# Altium project IOT_temperature.PrjPcb
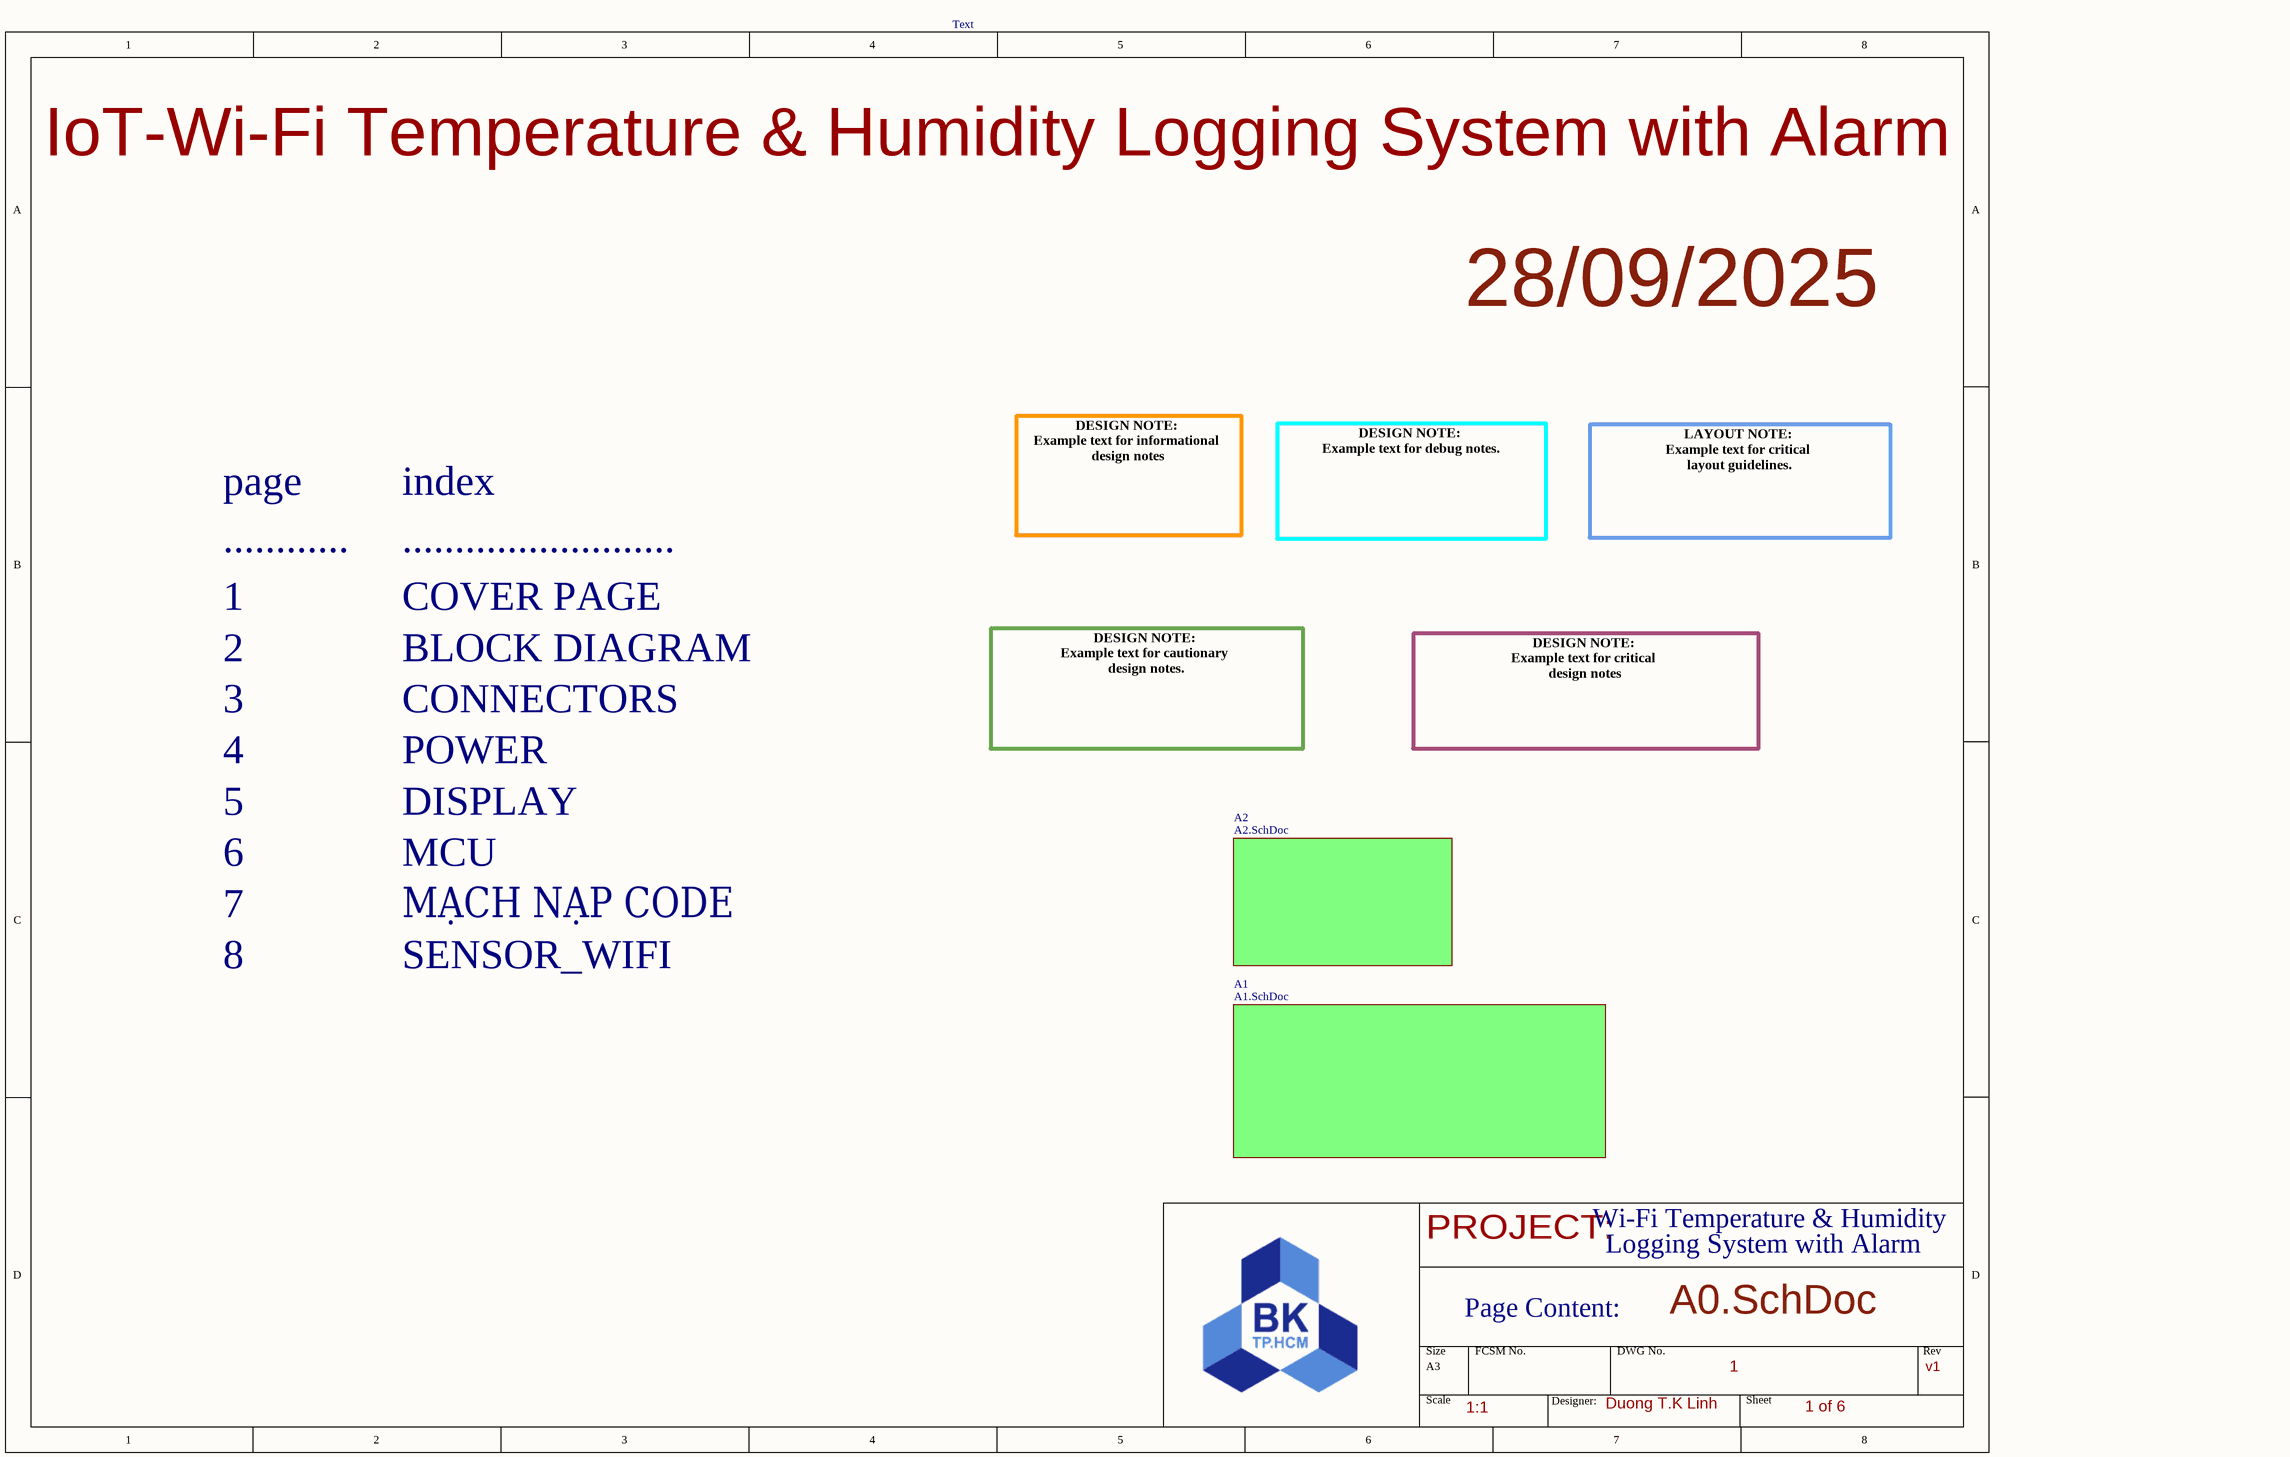
[diagram p0: A0.SchDoc]
6 sheets, 53 parts. Net scope: global (net labels, ports and power ports of the same name join across sheets).
Board files: PCB1.PcbDoc, PCB_IOT.PcbDoc
Sheets:
  A0.SchDoc
    A1 = A1.SchDoc
    A2 = A2.SchDoc
      poweranddisplay = power_display.SchDoc
      MCU = MCU.SchDoc
      sensor_wifi = sensor_wifi.SchDoc

## Sheet A0.SchDoc
size A3; SheetNumber: 1; SheetTotal: 6

### Sub-sheets
A1 = A1.SchDoc: no entries
A2 = A2.SchDoc: no entries

### Notes on the sheet
- Text
- IoT-Wi-Fi Temperature & Humidity Logging System with Alarm
- 28/09/2025
- page
- index
- ............
- ..........................
- DESIGN NOTE:
  Example text for informational
  design notes
- DESIGN NOTE:
  Example text for debug notes.
- LAYOUT NOTE:
  Example text for critical
  layout guidelines.
- 1
- COVER PAGE
- 2
- BLOCK DIAGRAM
- 3
- 4
- CONNECTORS
- POWER
- DESIGN NOTE:
  Example text for cautionary
  design notes.
- DESIGN NOTE:
  Example text for critical
  design notes
- 5
- DISPLAY
- 6
- MCU
- 7
- MẠCH NẠP CODE
- 8
- SENSOR_WIFI
- PROJECT:
- Wi-Fi Temperature & Humidity
- Logging System with Alarm
- Page Content:
- A0.SchDoc
- 1:1
- Designer:
- Duong T.K Linh
- 1 of 6
- v1

## Sheet A1.SchDoc
size A3; SheetNumber: 2; SheetTotal: 6
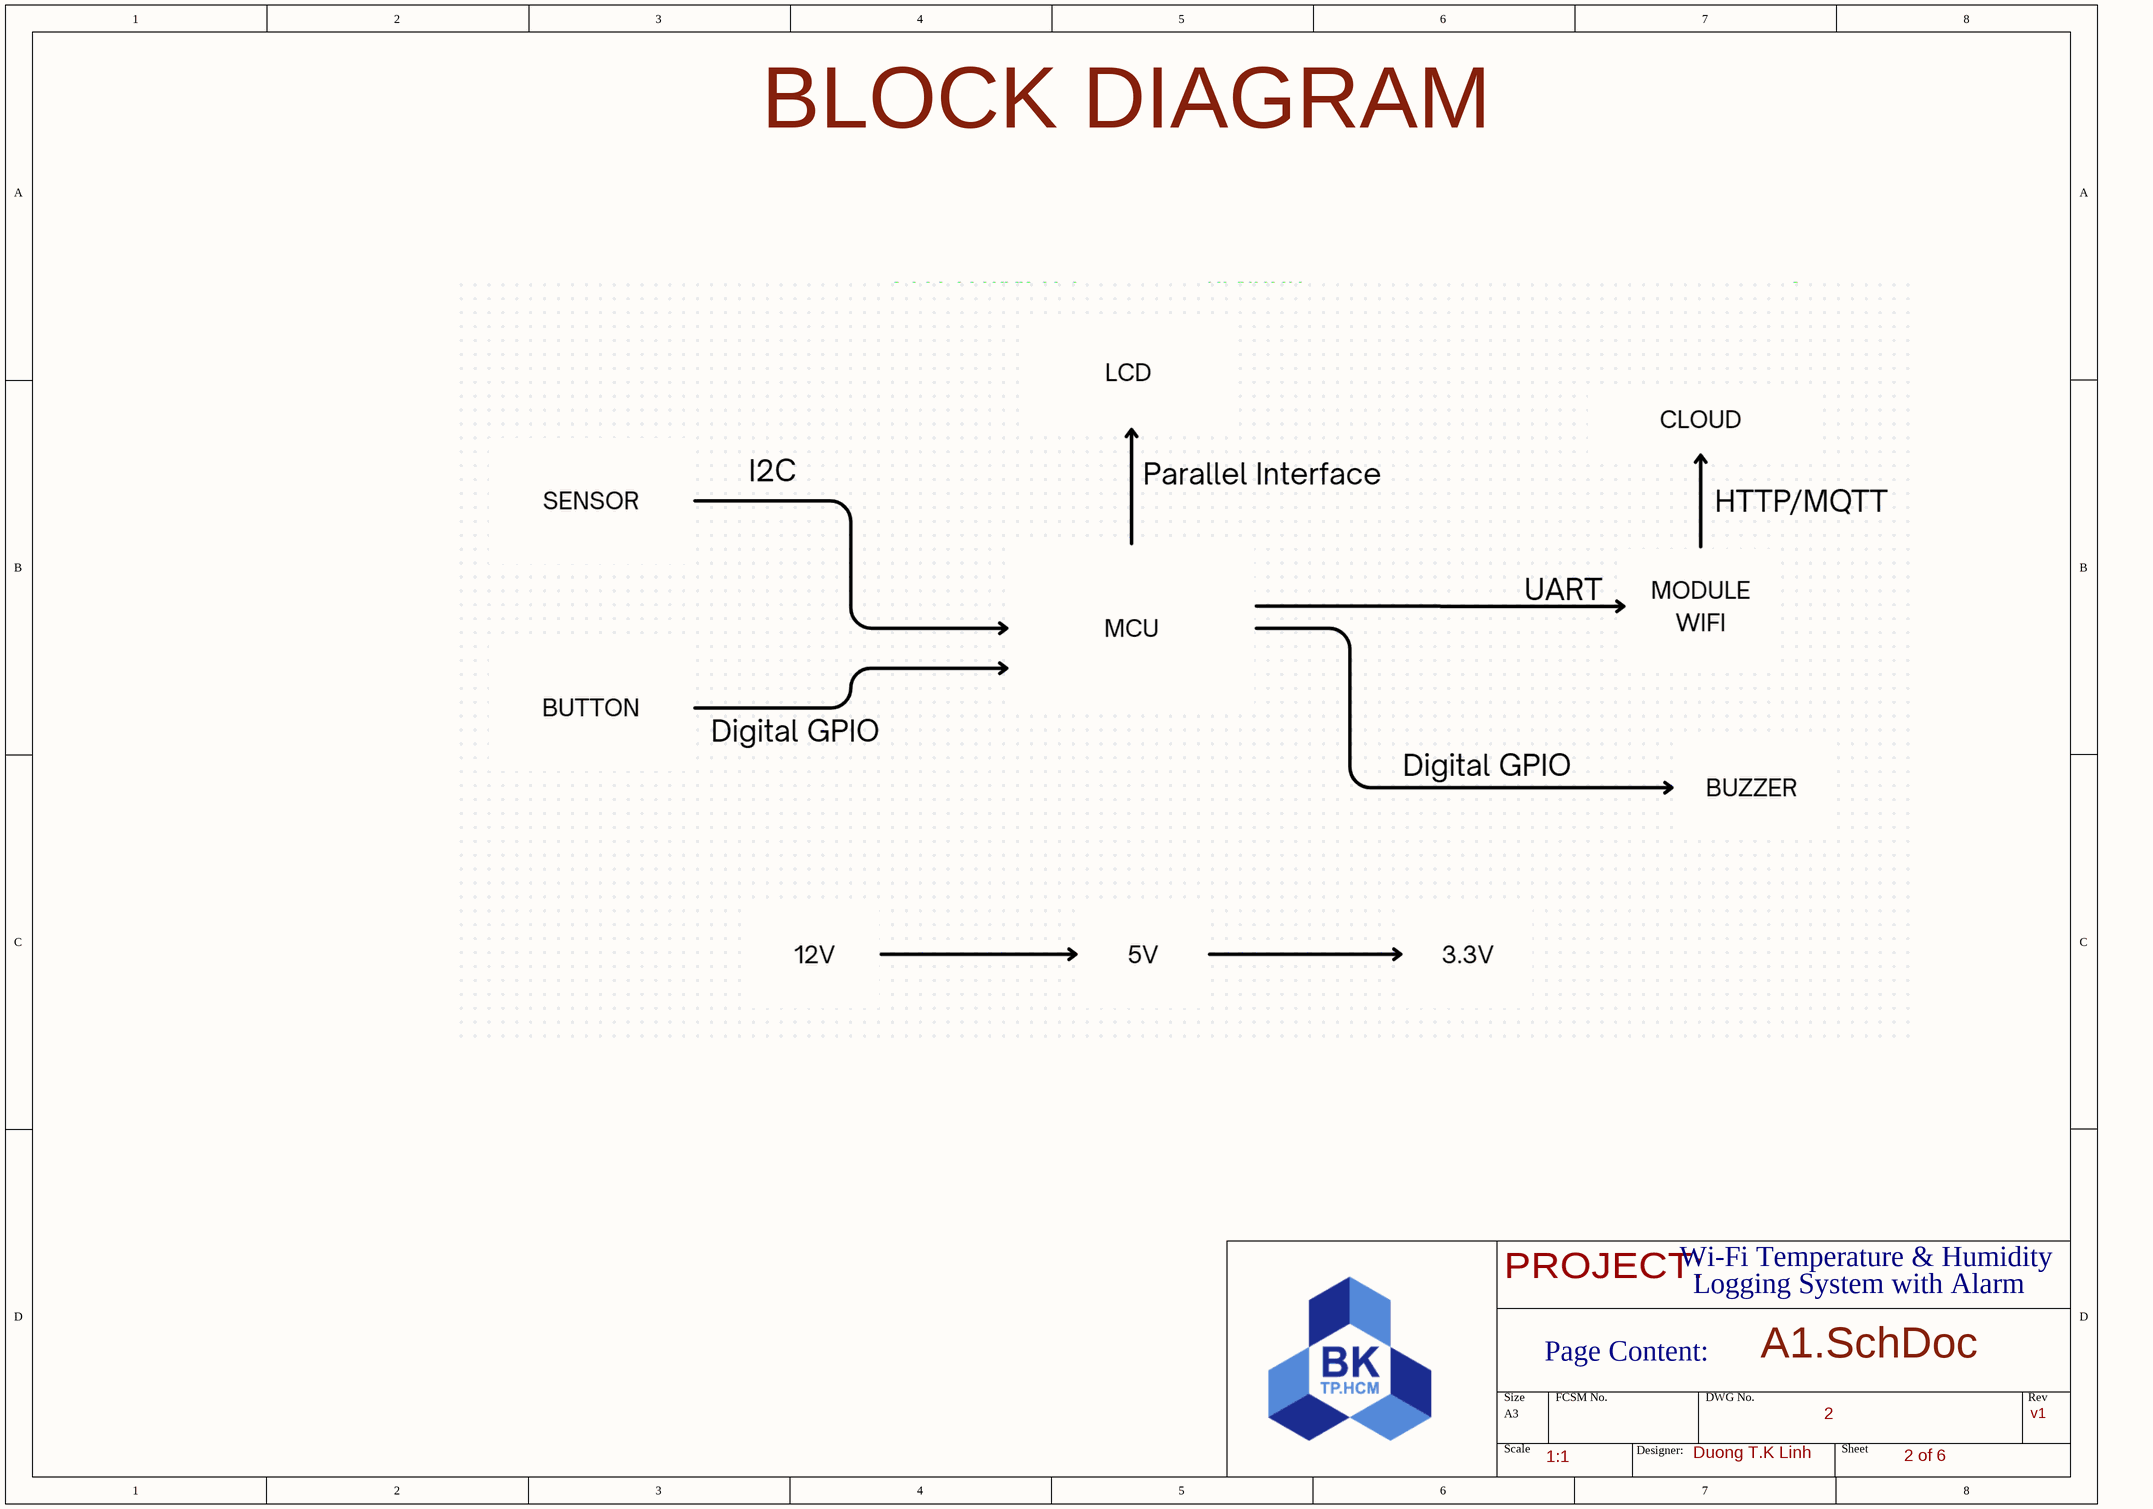
[diagram p1: A1.SchDoc]

### Notes on the sheet
- BLOCK DIAGRAM
- PROJECT:
- Wi-Fi Temperature & Humidity
- Logging System with Alarm
- Page Content:
- A1.SchDoc
- 1:1
- Designer:
- Duong T.K Linh
- 2
- 2 of 6
- v1

## Sheet A2.SchDoc
size A3; SheetNumber: 3; SheetTotal: 6
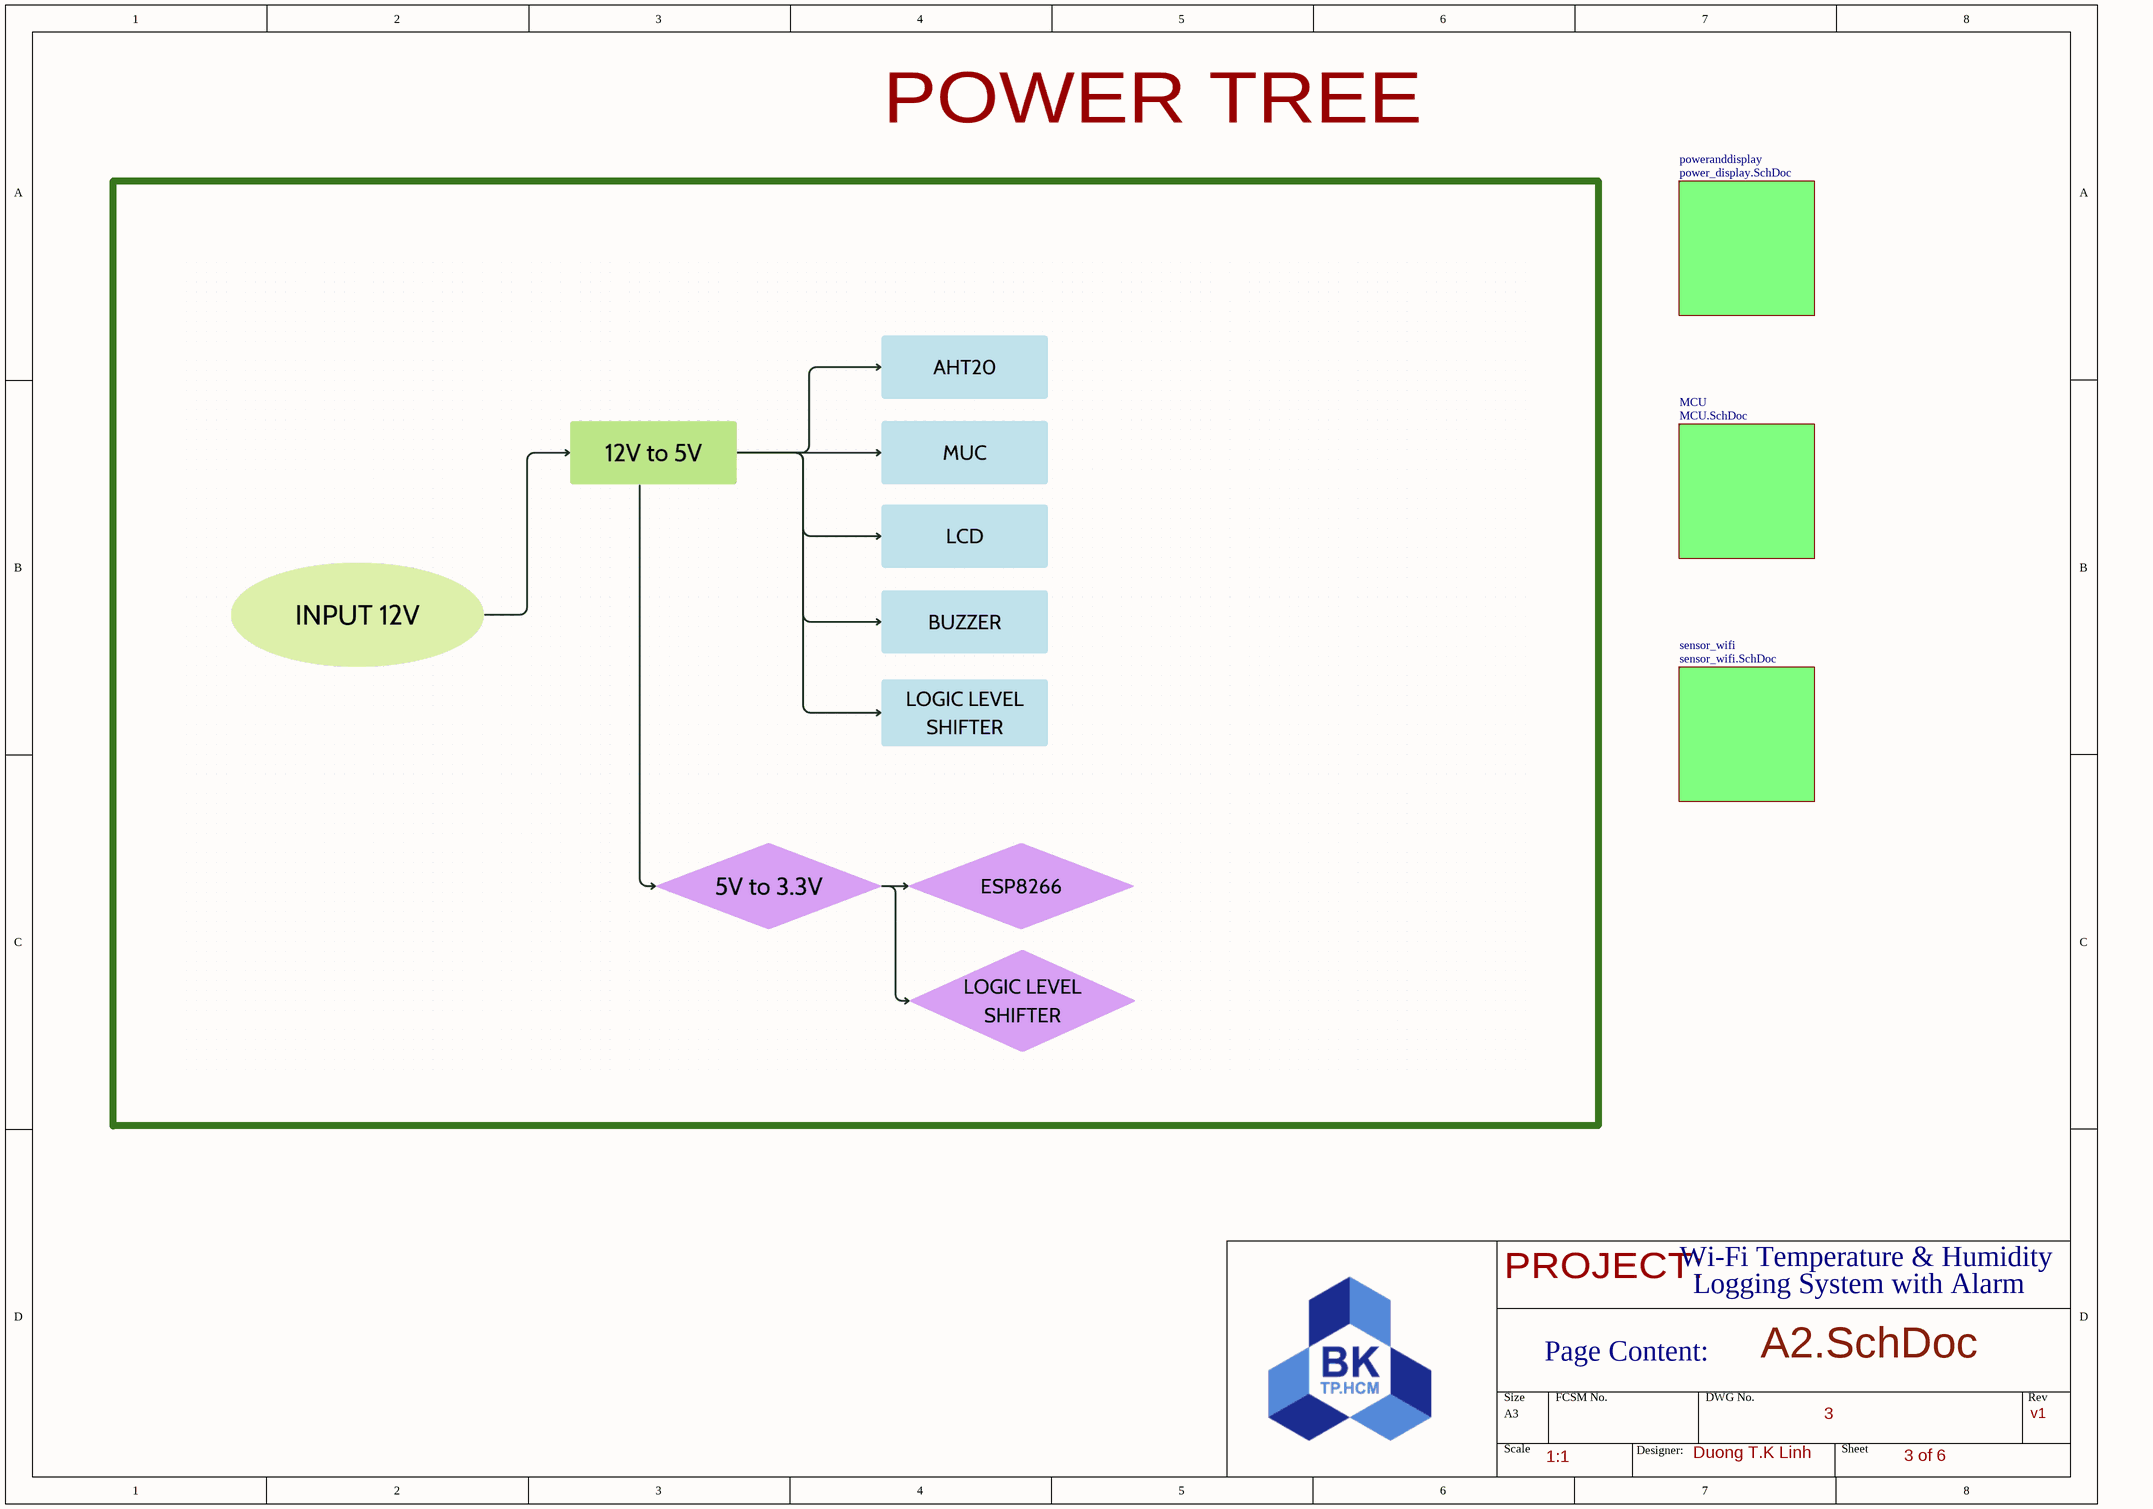
[diagram p2: A2.SchDoc]

### Sub-sheets
MCU = MCU.SchDoc: no entries
poweranddisplay = power_display.SchDoc: no entries
sensor_wifi = sensor_wifi.SchDoc: no entries

### Notes on the sheet
- POWER TREE
- PROJECT:
- Wi-Fi Temperature & Humidity
- Logging System with Alarm
- Page Content:
- A2.SchDoc
- 1:1
- Designer:
- Duong T.K Linh
- 3
- 3 of 6
- v1

## Sheet power_display.SchDoc
size A3; SheetNumber: 4; SheetTotal: 6
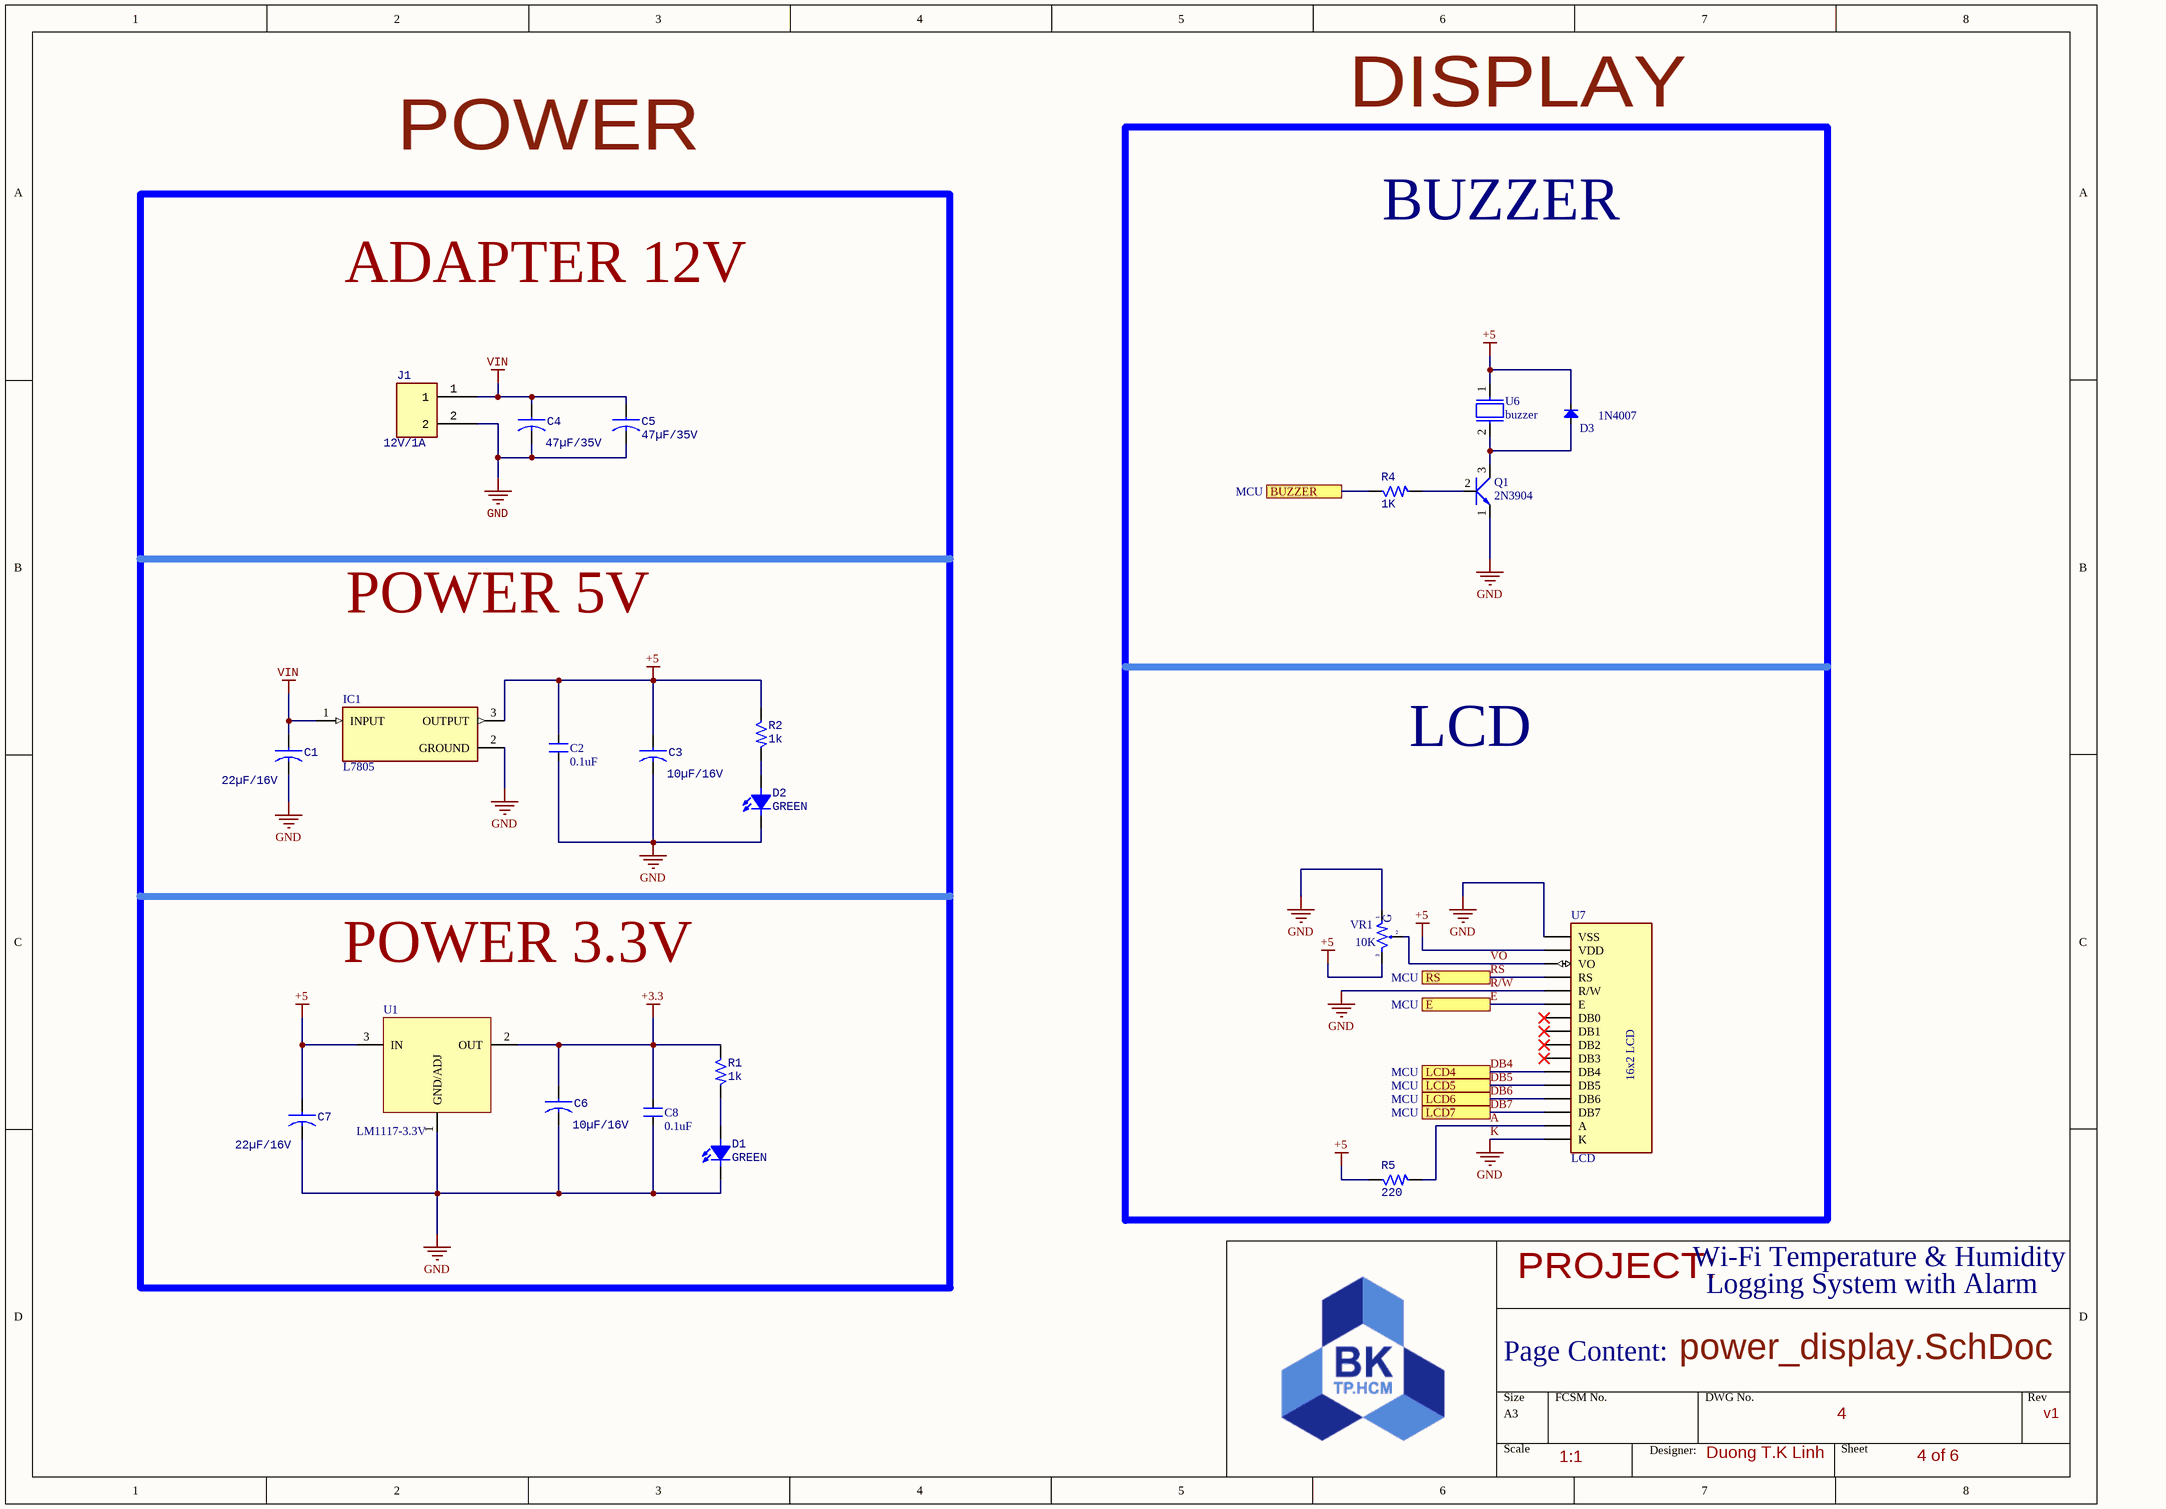
[diagram p3: power_display.SchDoc]

### Parts
C1  22µF/16V  [CP1/2]
C2  0.1uF  [CN2]
C3  10µF/16V  [CP1/2]
C4  47µF/35V  [CP1/2]
C5  47µF/35V  [CP1/2]
C6  10µF/16V  [CP1/2]
C7  22µF/16V  [CP1/2]
C8  0.1uF  [CN2]
D1  GREEN  [LED-5TRED]
D2  GREEN  [LED-5TRED]
D3  Diode  [DIO-1A]  (value not drawn)
IC1  L7805  [L7805]
J1  12V/1A  [J2-D1T]
Q1  2N3904  [TO92-123]
R1  1k  [RES-1/4W-SMALL]
R2  1k  [RES-1/4W-SMALL]
R4  1K  [RES-1/4W-SMALL]
R5  220  [RES-1/4W-SMALL]
U1  LM1117-3.3V  [TO220-123]
U6  buzzer  [buzzer]
U7  LCD  [LCD]
VR1  10K  [VR-S1]

### Blocks framed on the sheet
DISPLAY: D3 Q1 R4 R5 U6 U7 VR1

### Ports
BUZZER (see MCU), E (see MCU), LCD4 (see MCU), LCD5 (see MCU), LCD6 (see MCU), LCD7 (see MCU), RS (see MCU)

### Nets
+3.3: C6.1 C8.2 R1.1 U1.2(OUT)
+5: C2.2 C3.1 C7.1 D3.2(K) IC1.3(OUTPUT) R2.1 R5.1 U1.3(IN) U6.1 U7.2(VDD) VR1.3  [project net VCC]
GND: C1.2 C2.1 C3.2 C4.2 C5.2 C6.2 C7.2 C8.1 D1.2(K) D2.2(K) IC1.2(GROUND) J1.2 Q1.1(E) U1.1(GND/ADJ) U7.1(VSS) U7.5(R/W) U7.16(K) VR1.1  [also labelled K, R/W]
VIN: C1.1 C4.1 C5.1 IC1.1(INPUT) J1.1
A: R5.2 U7.15(A)
DB4: U7.11(DB4) ; port LCD4
DB5: U7.12(DB5) ; port LCD5
DB6: U7.13(DB6) ; port LCD6
DB7: U7.14(DB7) ; port LCD7
E: U7.6(E) ; port E
PD3: R4.1 ; port BUZZER
RS: U7.4(RS) ; port RS  [project net PD5]
VO: U7.3(VO) VR1.2
NetD1_1: D1.1(A) R1.2
NetD2_1: D2.1(A) R2.2
NetD3_1: D3.1(A) Q1.3(C) U6.2
NetQ1_2: Q1.2(B) R4.2

Not connected (* = marked no-connect by the designer): U7 7(DB0)* 8(DB1)* 9(DB2)* 10(DB3)*

### Notes on the sheet
- POWER
- BUZZER
- ADAPTER 12V
- (near D3) 1N4007
- POWER 5V
- LCD
- POWER 3.3V
- PROJECT:
- Wi-Fi Temperature & Humidity
- Logging System with Alarm
- Page Content:
- power_display.SchDoc
- 1:1
- Designer:
- Duong T.K Linh
- 4
- 4 of 6
- v1
- (in symbol LCD) 16x2 LCD
- (in symbol VR-S) G

### Library data of the parts
C1 C3 C6 C7 = ID-4: Mfr# #: EEH-ZA1V470P; VALUE: 47µF/35V; Design Item ID: ID-4
C2 C8 = CN2: Cap np 104 => 105pF; Value: 0.1uF
C4 C5 = ID-4: Mfr# #: EEH-ZA1V470P; Design Item ID: ID-4; VALUE: 47µF/35V
D1 D2 = ID-23: Green 569nm LED Indication - Discrete 2.1V 0603 (1608 Metric); Mfr# #: LTST-C190GKT; Design Item ID: ID-23; Value: GREEN
D3 = Diode: Default Diode; Code - JEDEC: DO-214-AB; Value: 1N5007; Published: 8-Jun-2000; Revision: July-2002: Re-released for DXP Platform.; Publisher: Altium Limited
J1 = ID-36: 2 Position Wire to Board Terminal Block Horizontal with Board 0.200" (5.08mm) Through Hole; Mfr# #: VI0221520000G; Design Item ID: ID-36
Q1 = 2N904: NPN 600mW, ECB; Value: C1815
R1 R2 R4 R5 = RES-SMD
U1 = LM1117: Low-Dropout Linear Regulator; Creator: Nguyen Ba Bien; Website: http://group3i.net
VR1 = VR-S: Var Resistor; Value: Volume 50k

## Sheet MCU.SchDoc
size A3; SheetNumber: 5; SheetTotal: 6
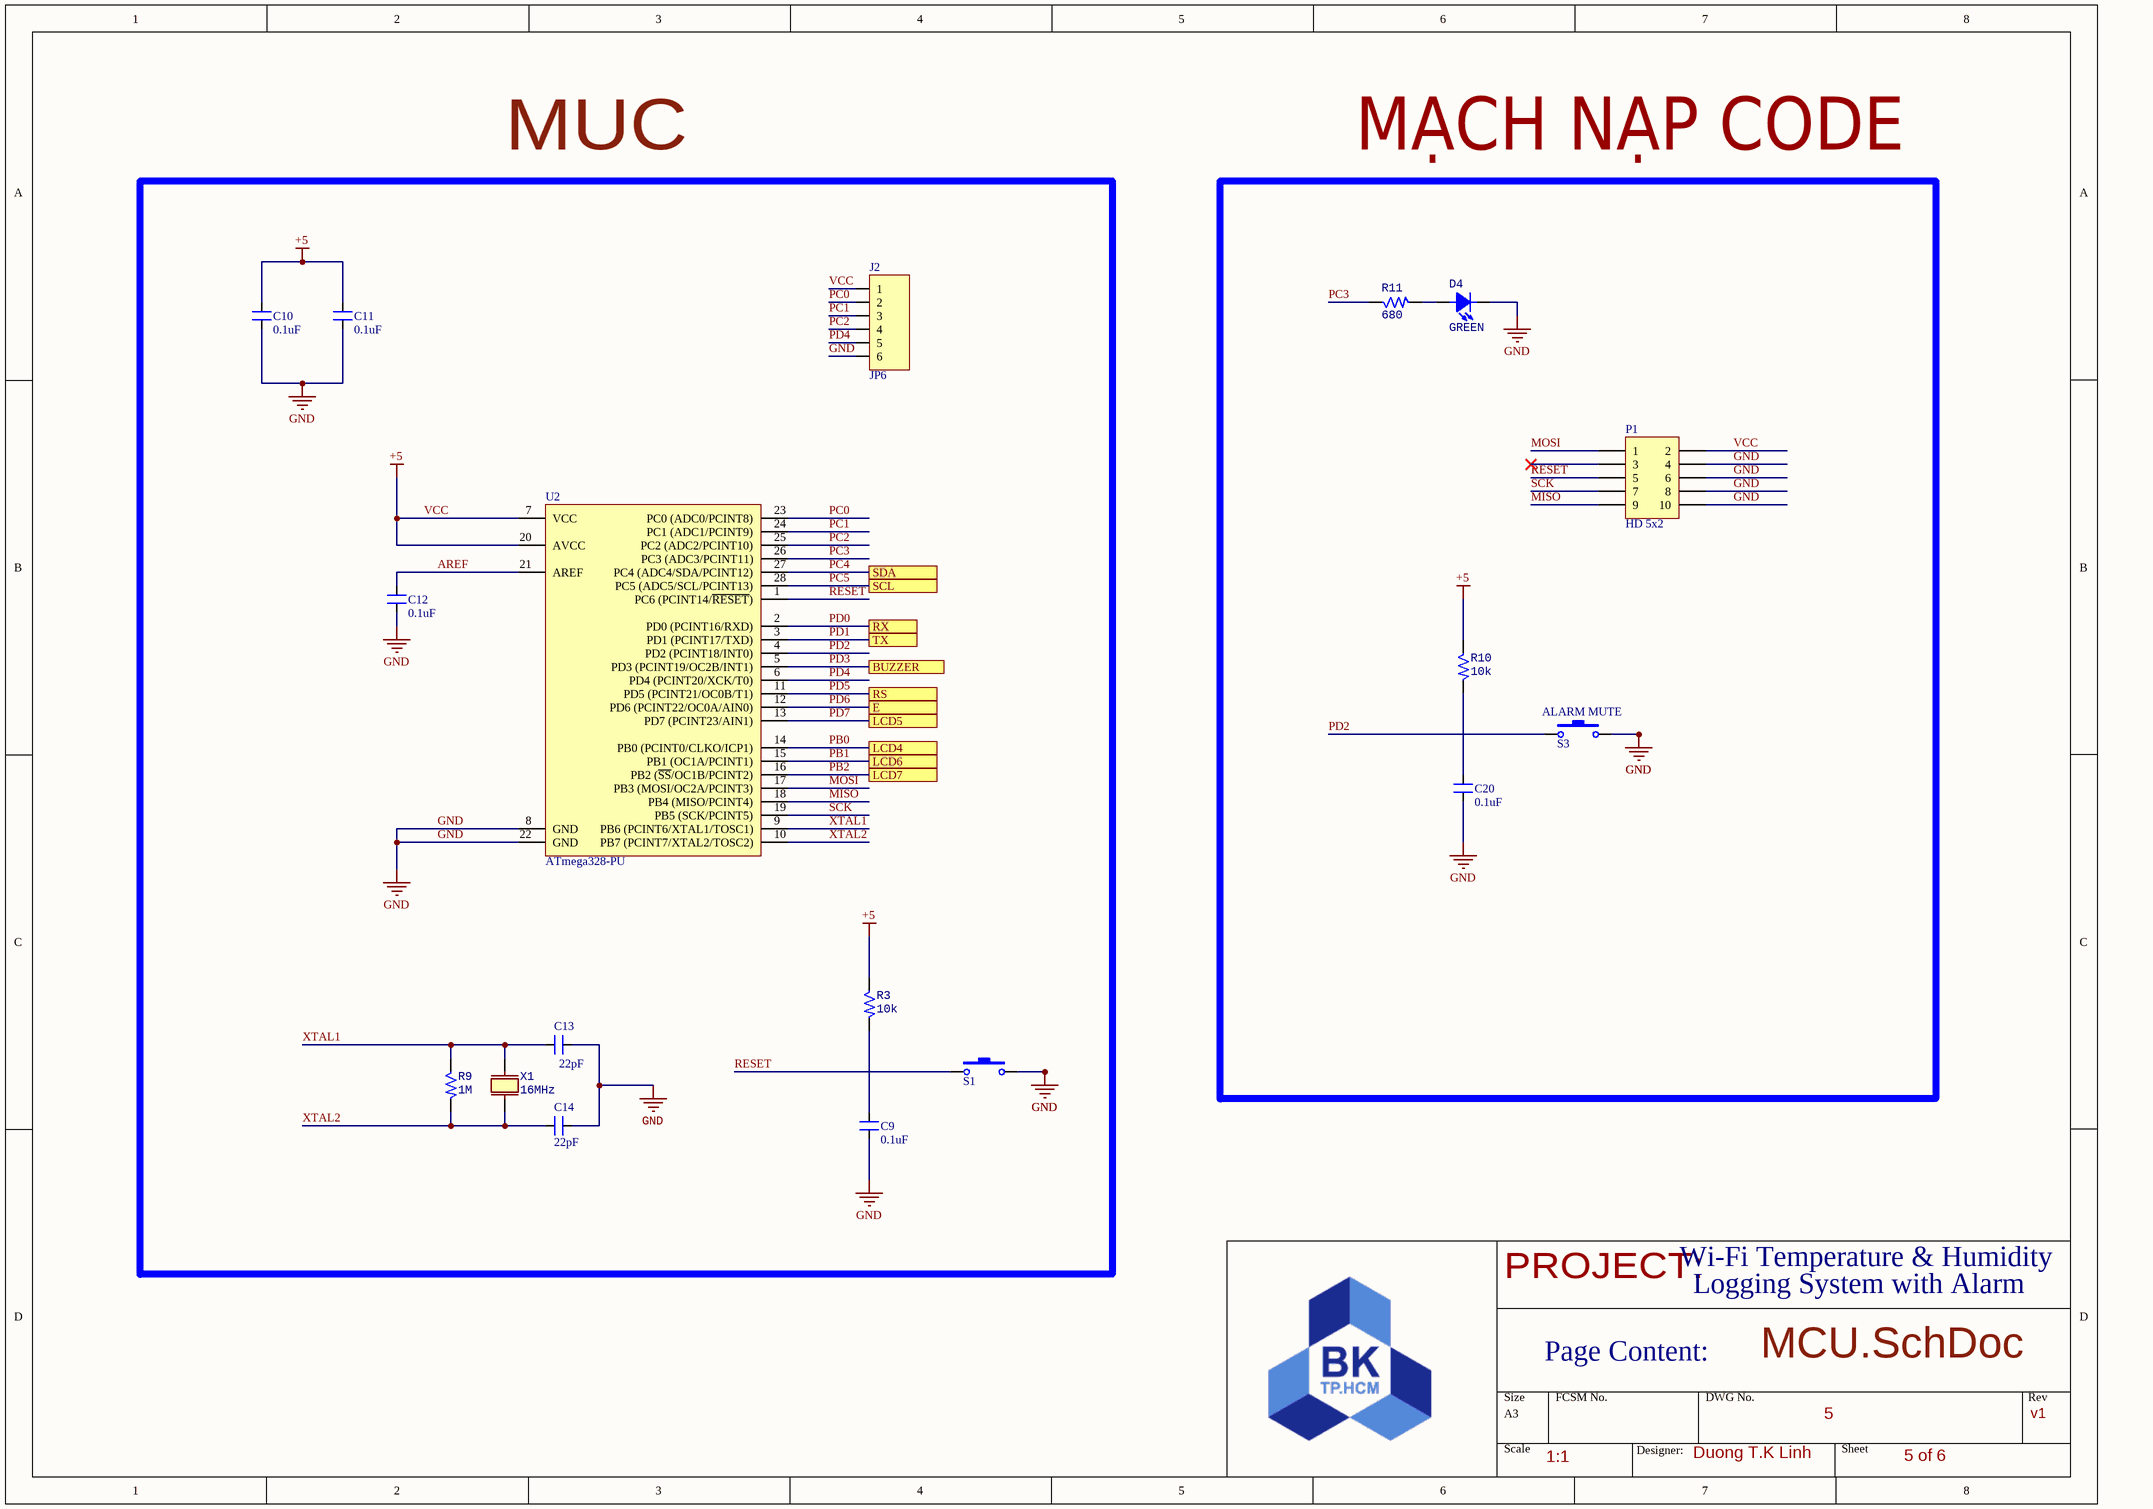
[diagram p4: MCU.SchDoc]

### Parts
C9  0.1uF  [CN2]
C10  0.1uF  [CN2]
C11  0.1uF  [CN2]
C12  0.1uF  [CN2]
C13  22pF  [CN3]
C14  22pF  [CN3]
C20  0.1uF  [CN2]
D4  GREEN  [LED-5TRED]
J2  JP6  [JP6-D1T]
P1  HD 5x2  [61201021621]
R3  10k  [RES-1/4W-SMALL]
R9  1M  [RES-1/4W-SMALL]
R10  10k  [RES-1/4W-SMALL]
R11  680  [RES-1/4W-SMALL]
S1  RESET MCU  [BUTTON  ROUND]  (value not drawn)
S3  ALARM MUTE  [BUTTON  ROUND]
U2  ATmega328-PU  [DIP28]
X1  16MHz  [XT2]

### Blocks framed on the sheet
MUC: C9-C14 J2 R3 R9 S1 U2 X1
MẠCH NẠP CODE: C20 D4 P1 R10 R11 S3

### Ports
BUZZER (see power_display), E (see power_display), LCD4 (see power_display), LCD5 (see power_display), LCD6 (see power_display), LCD7 (see power_display), RS (see power_display), RX (see sensor_wifi), SCL (see sensor_wifi), SDA (see sensor_wifi), TX (see sensor_wifi)

### Nets
GND: C9.1 C10.1 C11.1 C12.1 C13.2 C14.2 C20.1 D4.2(K) J2.6 P1.4 P1.6 P1.8 P1.10 S1.2 S3.2 U2.8(GND) U2.22(GND)
VCC: C10.2 C11.2 J2.1 P1.2 R3.1 R10.1 U2.7(VCC) U2.20(AVCC)  [also labelled +5]
AREF: C12.2 U2.21(AREF)
MISO: P1.9 U2.18(PB4_(MISO/PCINT4))
MOSI: P1.1 U2.17(PB3_(MOSI/OC2A/PCINT3))
PB0: U2.14(PB0_(PCINT0/CLKO/ICP1)) ; port LCD4  [project net DB4]
PB1: U2.15(PB1_(OC1A/PCINT1)) ; port LCD6  [project net DB6]
PB2: U2.16(PB2_(~{SS}/OC1B/PCINT2)) ; port LCD7  [project net DB7]
PC0: J2.2 U2.23(PC0_(ADC0/PCINT8))
PC1: J2.3 U2.24(PC1_(ADC1/PCINT9))
PC2: J2.4 U2.25(PC2_(ADC2/PCINT10))
PC3: R11.1 U2.26(PC3_(ADC3/PCINT11))
PC4: U2.27(PC4_(ADC4/SDA/PCINT12)) ; port SDA
PC5: U2.28(PC5_(ADC5/SCL/PCINT13)) ; port SCL
PD0: U2.2(PD0_(PCINT16/RXD)) ; port RX
PD1: U2.3(PD1_(PCINT17/TXD)) ; port TX
PD2: S3.1 U2.4(PD2_(PCINT18/INT0))
PD3: U2.5(PD3_(PCINT19/OC2B/INT1)) ; port BUZZER
PD4: J2.5 U2.6(PD4_(PCINT20/XCK/T0))
PD5: U2.11(PD5_(PCINT21/OC0B/T1)) ; port RS
PD6: U2.12(PD6_(PCINT22/OC0A/AIN0)) ; port E  [project net E]
PD7: U2.13(PD7_(PCINT23/AIN1)) ; port LCD5  [project net DB5]
RESET: P1.5 S1.1 U2.1(PC6_(PCINT14/~{RESET}))
SCK: P1.7 U2.19(PB5_(SCK/PCINT5))
XTAL1: C13.1 R9.1 U2.9(PB6_(PCINT6/XTAL1/TOSC1)) X1.2
XTAL2: C14.1 R9.2 U2.10(PB7_(PCINT7/XTAL2/TOSC2)) X1.1
NetC9_2: C9.2 R3.2
NetC20_2: C20.2 R10.2
NetD4_1: D4.1(A) R11.2

Not connected (* = marked no-connect by the designer): P1 3*

### Notes on the sheet
- PROJECT:
- Wi-Fi Temperature & Humidity
- Logging System with Alarm
- Page Content:
- MCU.SchDoc
- 1:1
- Designer:
- Duong T.K Linh
- 5
- 5 of 6
- v1

### Library data of the parts
C9-C12 C20 = CN2: Cap np 104 => 105pF; Value: 0.1uF
C13 C14 = CN3: Cap np W0.3; Value: 0,047uF; Copyright: VanDungEvn
D4 = ID-23: as D1 on sheet power_display; Design Item ID: ID-23; Value: GREEN
J2 = JP6: WR-PHD 2.54 mm Angled Socket Header; Manufacturer: W¨¹rth Elektronik eiSos GmbH; partNo: 613006143121; ComponentLink1 Description: Manufacturer; ComponentLink2 Description: Datasheet; NoPins: 06; Created Date: 29 March 2013; ComponentLink1URL: http://www.we-online.com; ComponentLink2URL: http://katalog.we-online.de/em/datasheet/6130xx143121.pdf; Created by: Karrer Zheng
R3 R9-R11 = RES-SMD
S1 S3 = SW-Button: Switch-Button; Published: 24-Mar-1999; LatestRevisionDate: 17-Jul-2002; LatestRevisionNote: Re-released for DXP Platform.; PackageReference: SPST-2; Publisher: Altium Limited
U2 = ATmega328-PU: 8-bit AVR Microcontroller, 32KB Flash, 1KB EEPROM, 2KB SRAM, 28-pin PDIP, Industrial Grade (-40°C to 85°C); Published: 1-Apr-2010; DatasheetVersion: revA, Jan-2010; PackageVersion: revB, Sep-2001; PackageReference: 28P3; Publisher: Altium Limited; PackageDescription: 28-lead (0.300"/7.62mm Wide) Plastic Dual Inline Package (PDIP); Supplier 1: Digi-Key; Supplier Part Number 1: ATMEGA328-PU-ND; Supplier 2: Mouser; Supplier Part Number 2: 556-ATMEGA328-PU; ComponentLink1Description: Manufacturer Link; ComponentLink1URL: http://www.atmel.com/products/avr/default.asp?; ComponentLink2Description: ATmega48A/48PA/88A/88PA/168A/168PA/328/328P Datasheet; ComponentLink2URL: http://www.atmel.com/dyn/resources/prod_documents/8271.pdf; ComponentLink3Description: ATmega48A/48PA/88A/88PA/168A/168PA/328/328P Summary; ComponentLink3URL: http://www.atmel.com/dyn/resources/prod_documents/8271S.pdf; ComponentLink4Description: Atmel.com Home; ComponentLink4URL: http://www.atmel.com
X1 = CRYSTAL 2PIN: Part Number: ABS07-120-32.768KHZ-T; Value: 32.768kHz

## Sheet sensor_wifi.SchDoc
size A3; SheetNumber: 6; SheetTotal: 6
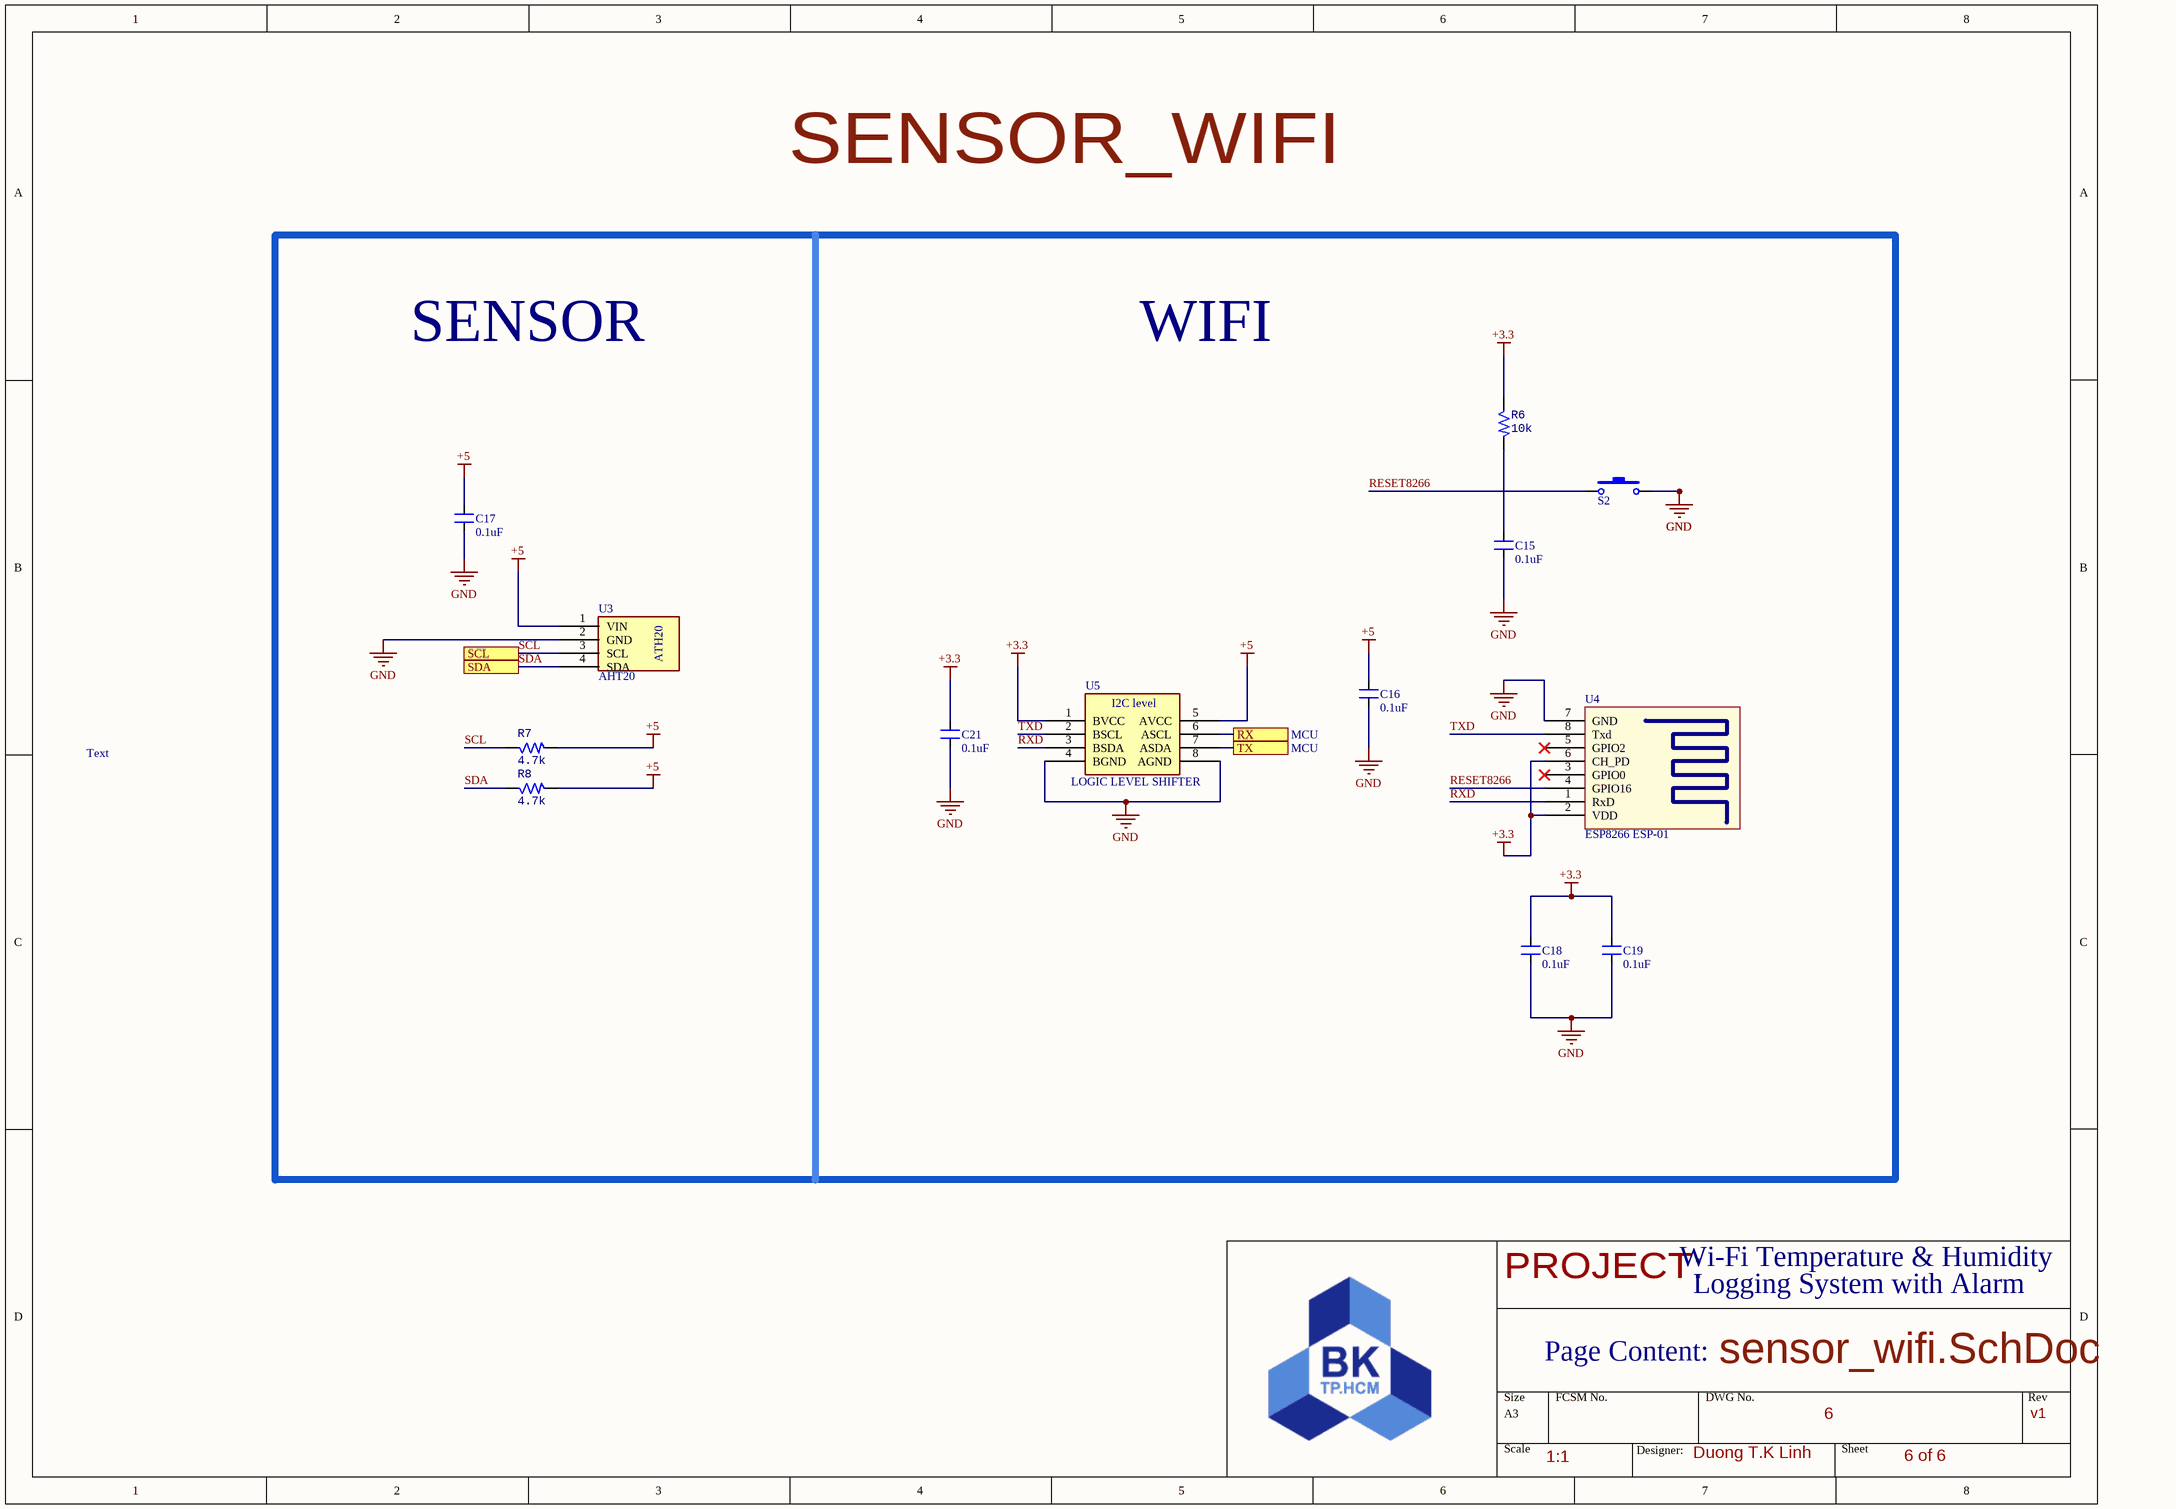
[diagram p5: sensor_wifi.SchDoc]

### Parts
C15  0.1uF  [CN2]
C16  0.1uF  [CN2]
C17  0.1uF  [CN2]
C18  0.1uF  [CN2]
C19  0.1uF  [CN2]
C21  0.1uF  [CN2]
R6  10k  [RES-1/4W-SMALL]
R7  4.7k  [RES-1/4W-SMALL]
R8  4.7k  [RES-1/4W-SMALL]
S2  RESET_WIFI  [BUTTON  ROUND]  (value not drawn)
U3  AHT20  [AHT20]
U4  ESP8266 ESP-01  [ESP8266 ESP-01]
U5  LOGIC LEVEL SHIFTER  [I2C LEVEL]

### Ports
RX (see MCU), SCL (see MCU), SDA (see MCU), TX (see MCU)

### Nets
+3.3: C18.2 C19.2 C21.2 R6.1 U4.2(VDD) U4.6(CH_PD) U5.1(BVCC)
+5: C16.2 C17.2 R7.2 R8.2 U3.1(VIN) U5.5(AVCC)  [project net VCC]
GND: C15.1 C16.1 C17.1 C18.1 C19.1 C21.1 S2.2 U3.2(GND) U4.7(GND) U5.4(BGND) U5.8(AGND)
PD0: U5.6(ASCL) ; port RX
PD1: U5.7(ASDA) ; port TX
RESET8266: S2.1 U4.4(GPIO16)
RXD: U4.1(RxD) U5.3(BSDA)
SCL: R7.1 U3.3(SCL) ; port SCL  [project net PC5]
SDA: R8.1 U3.4(SDA) ; port SDA  [project net PC4]
TXD: U4.8(Txd) U5.2(BSCL)
NetC15_2: C15.2 R6.2

Not connected (* = marked no-connect by the designer): U4 3(GPIO0)* 5(GPIO2)*

### Notes on the sheet
- SENSOR_WIFI
- SENSOR
- WIFI
- Text
- PROJECT:
- Wi-Fi Temperature & Humidity
- Logging System with Alarm
- Page Content:
- sensor_wifi.SchDoc
- 1:1
- Designer:
- Duong T.K Linh
- 6
- 6 of 6
- v1
- (in symbol i2c level) I2C level

### Library data of the parts
C15-C19 C21 = CN2: Cap np 104 => 105pF; Value: 0.1uF
R6-R8 = RES-SMD
S2 = SW-Button: Switch-Button; Published: 24-Mar-1999; LatestRevisionDate: 17-Jul-2002; LatestRevisionNote: Re-released for DXP Platform.; PackageReference: SPST-2; Publisher: Altium Limited
U3 = ATH20
U5 = i2c level

## Nets that join several sheets
+3.3: power_display (C6.1 C8.2 R1.1 U1.2), sensor_wifi (7 pins)
GND: power_display (18 pins), MCU (17 pins), sensor_wifi (11 pins)
VCC: power_display (11 pins), MCU (8 pins), sensor_wifi (6 pins)
DB4: power_display (U7.11), MCU (U2.14)
DB5: power_display (U7.12), MCU (U2.13)
DB6: power_display (U7.13), MCU (U2.15)
DB7: power_display (U7.14), MCU (U2.16)
E: power_display (U7.6), MCU (U2.12)
PC4: MCU (U2.27), sensor_wifi (R8.1 U3.4)
PC5: MCU (U2.28), sensor_wifi (R7.1 U3.3)
PD0: MCU (U2.2), sensor_wifi (U5.6)
PD1: MCU (U2.3), sensor_wifi (U5.7)
PD3: power_display (R4.1), MCU (U2.5)
PD5: power_display (U7.4), MCU (U2.11)